# EAGLE design slothbot_sensor_unit_3.0 (EAGLE 9.6.2)
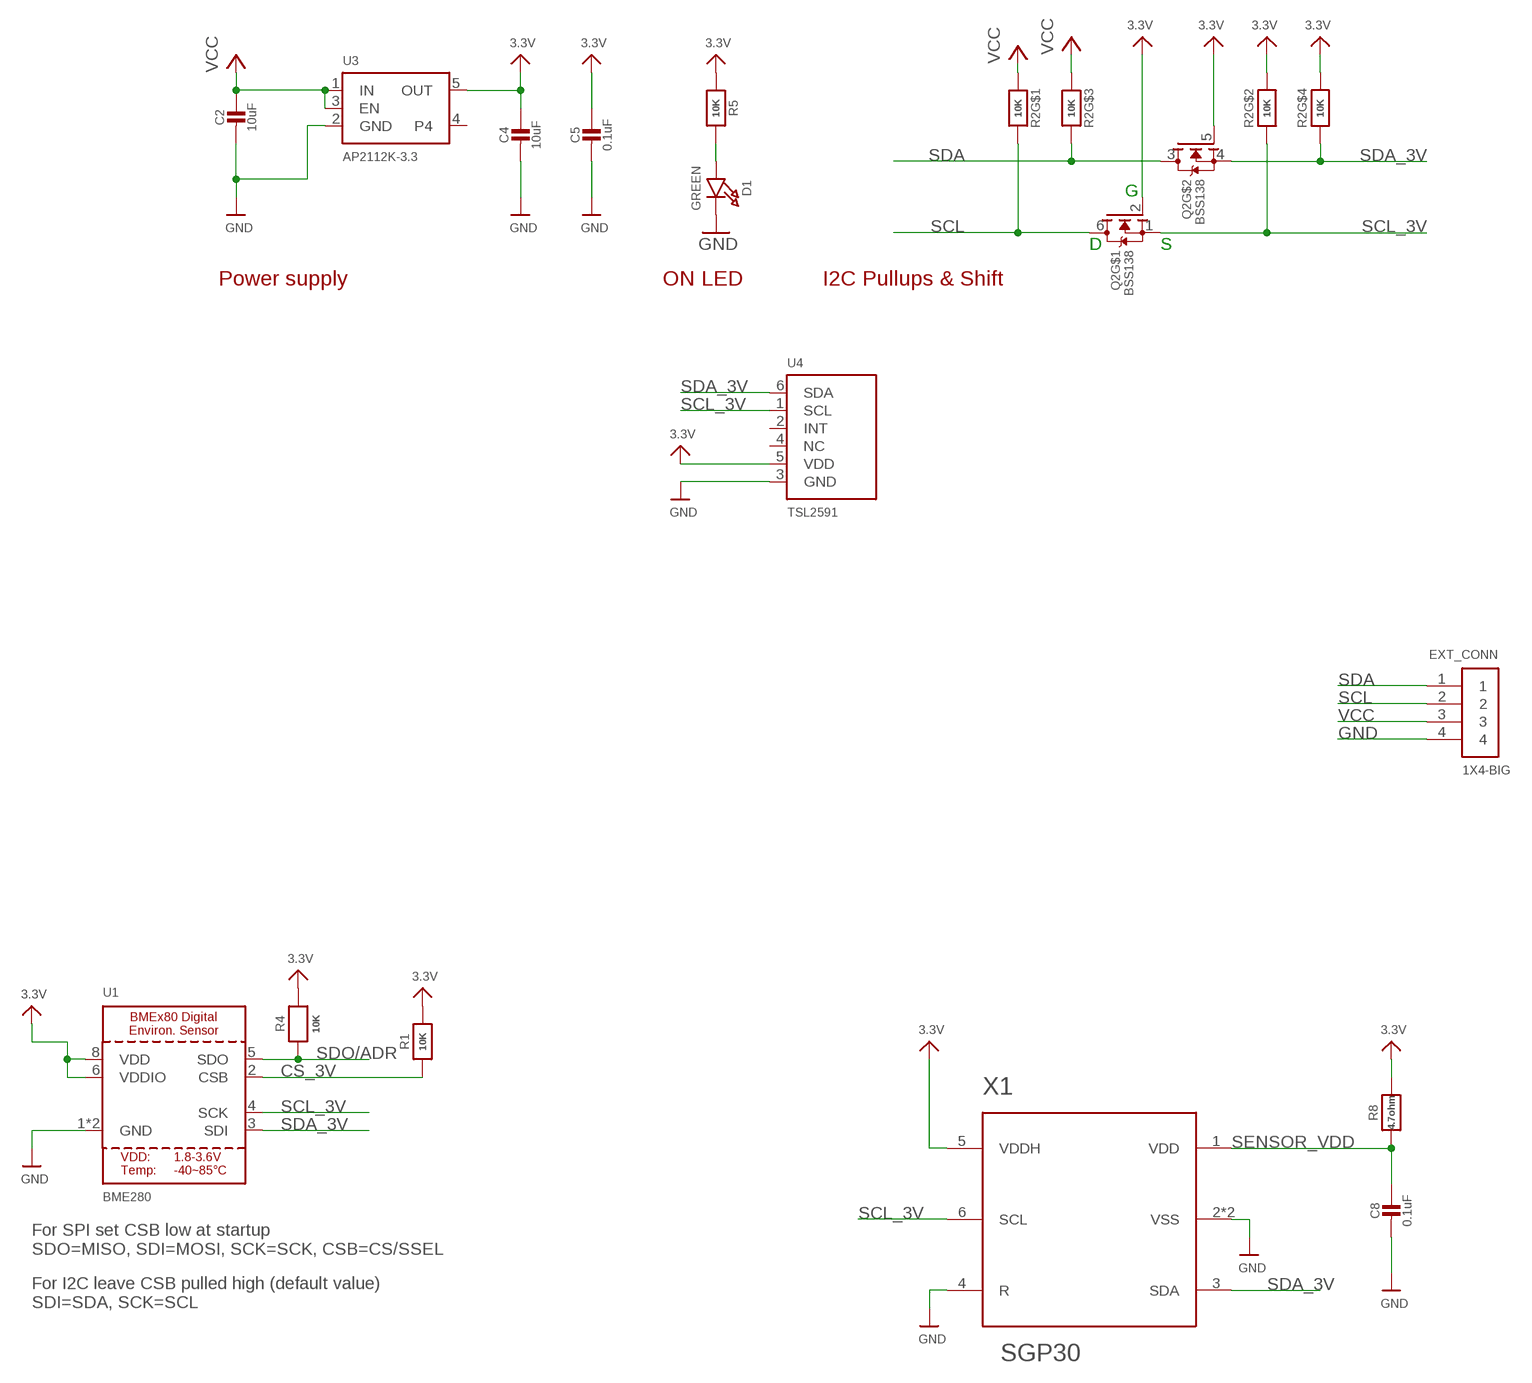
[diagram p0: schematic, sheet 1]

## Parts
C2  10uF  CAP_CERAMIC0805-NOOUTLINE  [0805-NO]
C4  10uF  CAP_CERAMIC0805-NOOUTLINE  [0805-NO]
C5  0.1uF  CAP_CERAMIC0603_NO  [0603-NO]
C8  0.1uF  CAP_CERAMIC0603_NO  [0603-NO]
D1  GREEN  LED0603_NOOUTLINE  [CHIPLED_0603_NOOUTLINE]
EXT_CONN  1X4-BIG  [1X04-BIG]
Q2  BSS138  MOSFET-N_DUAL  [SOT363]
R1  10K  RESISTOR_0603_NOOUT  [0603-NO]
R2  10K  RESISTOR_4PACK  [RESPACK_4X0603]
R4  10K  RESISTOR_0603_NOOUT  [0603-NO]
R5  10K  RESISTOR_0603_NOOUT  [0603-NO]
R8  4.7ohm  RESISTOR_0603_NOOUT  [0603-NO]
U1  BME280  [BME280]
U3  AP2112K-3.3  VREG_SOT23-5  [SOT23-5]
U4  TSL2591  LIGHT_TSL2591  [DFN6_TAOS]
X1  SGP30  [SGP30]

## Nets
3.3V: C4.1 C5.1 Q2.2(G) Q2.5(G) R1.2 R2.2 R2.4 R4.2 R5.1 R8.2 U1.6(VDDIO) U1.8(VDD) U3.5(OUT) U4.5(VDD) X1.5(VDDH)
CS_3V: R1.1 U1.2(CSB)
GND: C2.2 C4.2 C5.2 C8.2 D1.C EXT_CONN.4 U1.1(GND) U1.7(GND) U3.2(GND) U4.3(GND) X1.2(VSS) X1.4(R) X1.P$7(VSS)
N$1: D1.A R5.2
SCL: EXT_CONN.2 Q2.6(D) R2.8
SCL_3V: Q2.1(S) R2.7 U1.4(SCK) U4.1(SCL) X1.6(SCL)
SDA: EXT_CONN.1 Q2.3(D) R2.6
SDA_3V: Q2.4(S) R2.5 U1.3(SDI) U4.6(SDA) X1.3(SDA)
SDO/ADR: R4.1 U1.5(SDO)
SENSOR_VDD [lowpower]: C8.1 R8.1 X1.1(VDD)
VCC [highpower]: C2.1 EXT_CONN.3 R2.1 R2.3 U3.1(IN) U3.3(EN)
Unconnected: U3.4 U4.2(INT) U4.4(NC)

## Notes on the sheet
- G
- D | S
- Power supply | ON LED | I2C Pullups & Shift
- For SPI set CSB low at startup
  SDO=MISO, SDI=MOSI, SCK=SCK, CSB=CS/SSEL
- For I2C leave CSB pulled high (default value)
  SDI=SDA, SCK=SCL

## Library data of the parts
C2 C4 C5 C8 = microbuilder:CAP_CERAMIC: Ceramic Capacitors For new designs, use the packages preceded by an '_' character since they are more reliable: The following footprints should be used on most boards: _0402 - Standard footprint for regular board layouts _0603 - Standard footprint for regular board layouts _0805 - Standard footprint for regular board layouts _1206 - Standard footprint for regular board layouts For extremely tight-pitch boards where space is at a premium, the following 'micro-pitch' footprints can be used (smaller pads, no silkscreen outline, etc.): _0402MP - Micro-pitch footprint for very dense/compact boards _0603MP - Micro-pitch footprint for very dense/compact boards _0805MP - Micro-pitch footprint for very dense/compact boards _1206MP - Micro-pitch footprint for very dense/compact boards
D1 = microbuilder:LED: LED 0603 - 0603 Surface Mount Package 2mA: Green LED - Low Power (3.9mcd, 2ma, 1.7Vf) - Digikey: 475-2709-2-ND Orange LED - Low Power (9.8mcd, 2ma, 1.8Vf) - Digikey: 475-1194-2-ND Red LED - Low Power (5mcd, 2ma, 1.8Vf) - Digikey: 475-1195-2-ND Yellow LED - Low Power (7mcd, 2ma, 1.8Vf) - Digikey: 475-1196-2-ND 5mA: Blue LED - Low Power (17mcd, 5ma, 2.9Vf) - Digikey: LNJ937W8CRACT-ND 0805 - 0805 Surface Mount Package 2mA: Red LED (8.8mcd, 2mA, 1.8Vf, Clear) - Low Power [Digikey: 475-2510-1-ND] Green LED (5mcd, 2mA, 1.8Vf, Clear) - Low Power [Digikey: 475-2730-1-ND] Yellow LED (11.3mcd, 2mA, 1.8Vf, Clear) - Low Power [Digikey: 475-2555-1-ND] 20mA: Red LED (104mcd, 20mA, Diffused) - LS R976 [Digikey: 475-1278-6-ND] Red LED (12mcd, 20mA, 2.0Vf, Clear) - APT2012EC [Digikey: 754-1128-1-ND] Green LED (15mcd, 20mA, 2.2Vf, Clear) - APT2012GC [Digikey: 754-1131-1-ND] Orange LED (160mcd, 20mA, 2.1Vf, Clear) - APT2012SECK [Digikey: 754-1130-1-ND] 1206 - 1206 Surface Mount Package Green LED (26mcd, 20mA, Diffused) - LG N971 [Digikey: 475-1407-6-ND] Red LED (15mcd, 20mA, Diffused) - LH N974 [Digikey: 475-1416-6-ND] Cree - Cree High-Power Surface Mount LEDs XPEBWT-L1-0000-00D50 - White 111lm 350mA 2.9Vf 6200K 110° XTEAWT-00-0000-00000LEE3 - White 114lm 350mA 2.85Vf 5000K 115° Everlight - Everlight 45-21 Series Surface Mount LEDs 45-21/QK2C-B2832AC2CB2/2T - Warm White 2000mcd 20mA 3.25Vf 3050K 120° 45-21/LK2C-B38452C4CB2/2T - Nuetral White 2000mcd 20mA 3.25Vf 4150K 120° 45-21/LK2C-B50634C6CB2/2T - Cold White 2200mcd 20mA 3.25Vf 5650K 120° PLCC2 Reverse Mount LS T77K-J1L2-1-0-2-R18-Z - Red 11.25mcd 2mA 1.8Vf 630nm 120° LO T77K-L1M2-24-Z - Orange 19.6mcd 2mA 1.8Vf 606nm 120° LY T77K-K2M1-26-Z - Yellow 15.7mcd 2mA 1.8Vf 587nm 120°
EXT_CONN = adafruit:1X4: 4-pin connector
Q2 = microbuilder:MOSFET-N_DUAL: Dual N-Channel MOSFET SOT363 (2.0x1.25mm) 2N7002PS - 60V, 320mA [Digikey: 568-5984-1-ND]
R1 R4 R5 R8 = microbuilder:RESISTOR: Resistors For new designs, use the packages preceded by an '_' character since they are more reliable: The following footprints should be used on most boards: _0402 - Standard footprint for regular board layouts _0603 - Standard footprint for regular board layouts _0805 - Standard footprint for regular board layouts _1206 - Standard footprint for regular board layouts For extremely tight-pitch boards where space is at a premium, the following 'micro-pitch' footprints can be used (smaller pads, no silkscreen outline, etc.): _0402MP - Micro-pitch footprint for very dense/compact boards _0603MP - Micro-pitch footprint for very dense/compact boards _0805MP - Micro-pitch footprint for very dense/compact boards _1206MP - Micro-pitch footprint for very dense/compact boards
R2 = microbuilder:RESISTOR_4PACK: Resistor Packs (4 resistors) 4 x 0603 10K 1/16W - Digikey: YC164J-10KCT-ND
U1 = microbuilder:BME280: BME280 - Environmental Sensor (I2C + SPI)
U3 = microbuilder:VREG_SOT23-5: SOT23-5 Fixed Voltage Regulators Part Current Out V Out V In V Dropout θJA (°C/W) TJ (°C) Digikey Part No. ADP121 150mA 3.3V 3.4-5.5V 0.09V @ 150mA -- -- ADP121-AUJZ33R7CT-ND ADP121 150mA 3.0V 3.1-5.5V 0.09V @ 150mA -- -- ADP121-AUJZ30R7CT-ND ADP122 300mA 3.3V 3.4-5.5V 0.085V @ 300mA -- -- ADP122AUJZ-3.3-R7CT-ND ADP1712 300mA 3.3V 3.5-5.5V 0.17V @ 300mA -- -- ADP1712AUJZ-3.3-R7TR-ND AP7311 (Low Cost) 150mA 3.3V 3.5-6V 0.15V @ 150mA -- -- AP7311-33WG-7DICT-ND LD39015M18R 150mA 1.8V 1.9V-5.5V 0.08V @ 100mA -- -- 497-6977-1-ND LP2985A-33DBVR 150mA 3.3V 3.3-16V 0.28V @ 150mA 206 150 296-18479-1-ND MCP1824T-3302E/OT 300mA 3.3V 3.5V-6V 0.2V @ 300mA -- -- MCP1824T-3302E/OTCT-ND MIC5205-2.5YM5 TR 150mA 2.5V 2.7-16V 0.165V @ 150mA -- -- 576-1257-2-ND MIC5205-3.0YM5 TR 150mA 3.0V 3.2V-16V 0.165V @ 150mA -- -- 576-1258-2-ND MIC5205-3.3YM5 TR 150mA 3.3V 3.5V-16V 0.165V @ 150mA -- -- 576-1259-2-ND TPS780330220 150mA 3.3V+2.2V 3.6-5.5V 250mV Max -- -- 296-23332-1-ND TDA3663/N1,135 100mA 3.3V 3.5-45V 0.18V @ 50mA -- -- 568-5343-1-ND Max operating temp can be calculated using θJA, TJ (max junction temperature), and power in watts. Set the "Maximum Ambient Temperature" until it reaches TJ ("Max Junction Temperature"), which is the absolute limit for safe use of the regulator: Heat Sink Temperature Calculator <http://www.daycounter.com/Calculators/Heat-Sink-Temperature-Calculator.phtml> For example, With 12V source into a 3.3V LP2985 and a 30mA load, we are dissipating (12V-3.3V) * 0.03A = 0.261W. With a θJA of 206 °C/W, a TJ of 150°C, and 261mW we can safely use the chip without a heat sink up to 75°C (=147.1°C Junction Temperature).
U4 = microbuilder:LIGHT_TSL2591: TSL2591 Light-To-Digital Sensor
X1 = microbuilder:SGP30: Sensirion SGP30 multi-pixel gas sensor

## Net classes
1 highpower: width 0.305 mm, drill 0.483 mm
2 lowpower: width 0.254 mm, drill 0.483 mm

## Board
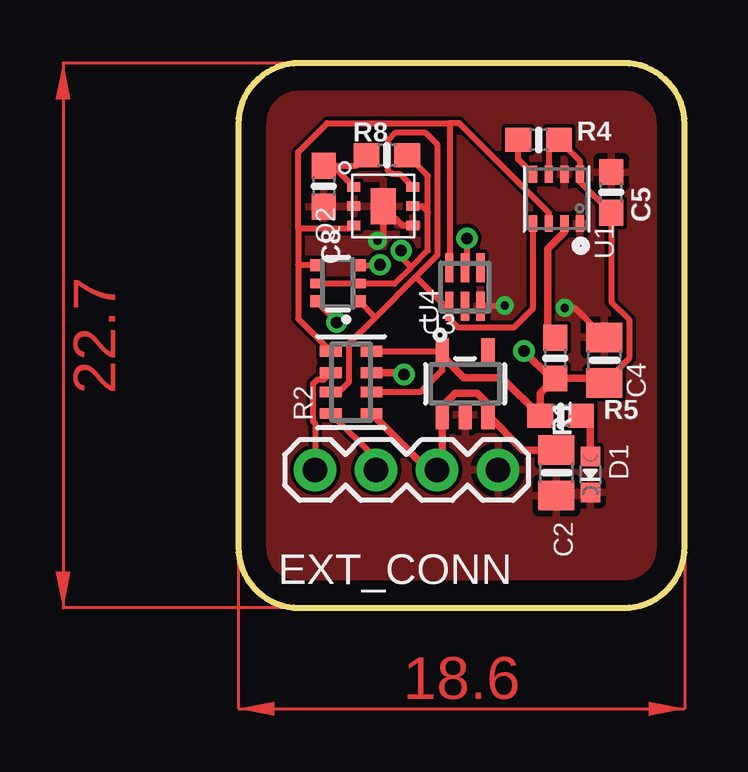
[diagram p1: board, top side]
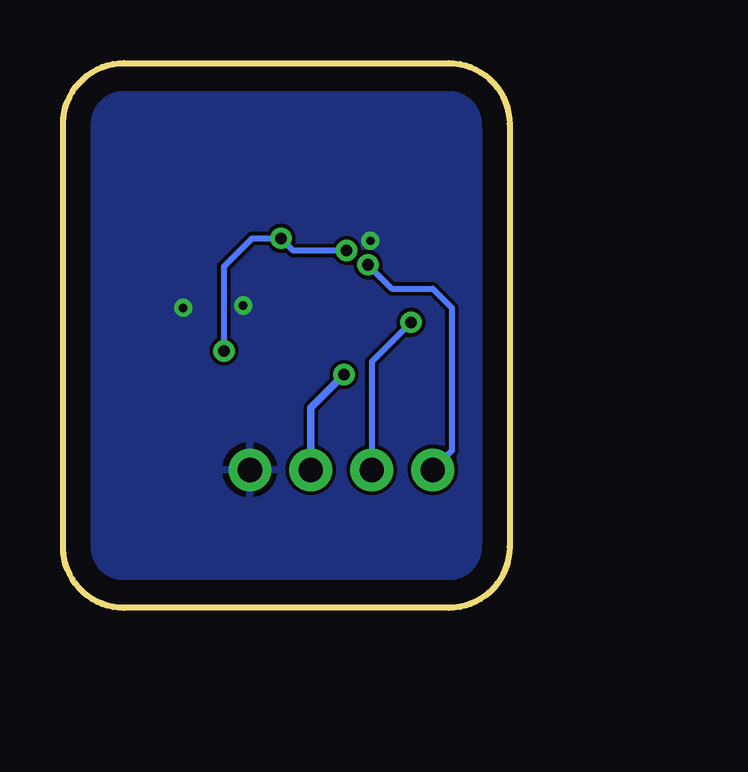
[diagram p2: board, bottom side, seen from below]

Size 18.6 x 22.7 mm. Coordinates in mm from the lower left corner, seen from the top.
Outline: 0,20.16 0,2.54 arc90 2.54,0 16.06,0 arc90 18.6,2.54 18.6,20.16 arc90 16.06,22.7 2.54,22.7 arc90 0,20.16
Copper layers (1*16): Top 0.035mm / dielectric 1.5mm / Bottom 0.035mm
Design rules "default": minimum track width 6mil, minimum drill 0.35mm, track to track 6mil, track to pad 6mil, pad to pad 6mil, via to via 6mil, smd to smd 6mil, copper to edge 40mil, drill to drill 6mil, minimum pad ring 10mil, minimum via ring 8mil, stop-mask expansion 4mil, vias tented up to drill 0mil, thermal gap 10mil

### Footprints (pad centres in the part's own frame; a part is rotated, then mirrored left to right if it is on the bottom)
0805-NO = smd 1.24 x 1.5: 1 -0.95,0; 2 0.95,0
0603-NO = smd 1.075 x 1: 1 -0.85,0; 2 0.85,0
CHIPLED_0603_NOOUTLINE = smd 0.8 x 0.8: A 0,-0.75; C 0,0.75
1X04-BIG = drill 1.016 pad 1.778: 1 0,0; 2 2.54,0; 3 5.08,0; 4 7.62,0
SOT363 = smd 0.5 x 0.5: 1 -0.75,-0.9; 3 0.75,-0.9; 4 0.75,0.9; 6 -0.75,0.9 | smd 0.4 x 0.5: 2 0,-0.9; 5 0,0.9
RESPACK_4X0603 = smd 0.45 x 0.9: 1 -1.3,-0.85; 2 -0.4,-0.85; 3 0.4,-0.85; 4 1.3,-0.85; 5 1.3,0.85; 6 0.4,0.85; 7 -0.4,0.85; 8 -1.3,0.85
BME280 = smd 0.7 x 0.35: 1 1.025,0.975; 2 1.025,0.325; 3 1.025,-0.325; 4 1.025,-0.975; 5 -1.025,-0.975; 6 -1.025,-0.325; 7 -1.025,0.325; 8 -1.025,0.975
SOT23-5 = smd 0.55 x 1.2: 1 -0.95,-1.3; 2 0,-1.3; 3 0.95,-1.3; 4 0.95,1.3; 5 -0.95,1.3
DFN6_TAOS = smd 1.2 x 0.35: 1 -0.8,0.65; 2 -0.8,0; 3 -0.8,-0.65; 4 0.8,-0.65; 5 0.8,0; 6 0.8,0.65
SGP30 = smd 0.55 x 0.4: 1 -1.225,0.8; 2 -1.225,0; 3 -1.225,-0.8; 4 1.225,-0.8; 5 1.225,0; 6 1.225,0.8 | smd 1.05 x 1.5: P$7 0,0

### Placement (x,y rotation side)
C2  13.25,5.63 270 top
C4  15.25,10.32 90 top
C5  15.54,17.31 90 top
C8  3.56,17.57 270 top
D1  14.67,5.56 180 top
EXT_CONN  3.2,5.75 0 top
Q2  4.15,13.52 90 top
R1  13.2,10.41 270 top
R2  4.7,9.4 90 top
R4  12.51,19.5 0 top
R5  13.43,8 0 top
R8  6.19,18.86 0 top
U1  13.26,17.04 270 top
U3  9.45,9.34 0 top
U4  9.44,13.37 90 top
X1  6.04,16.74 0 top

### Tracks (layer width: path | path; a pad name or v marks a point on that pad's centre or on a via)
3.3V  (via drill 0.48)
  Top 0.254: R2.2 7.6,9 8.5,9.9 8.5,10.5 U3.5 8.44,10.7 R2.4 | X1.5 7.66,16.74 7.9,16.5 | 7.9,16.5 7.9,14.9 7.2,14.2 | 7.2,14.2 6.5,13.5 5.07,13.5 Q2.2 Q2.5 | U1.6 12.94,19.07 R4.2 14.24,18.62 U1.8 14.24,17.77 C5.1 15.54,12.74 16.28,12.01 16.28,10.4 C4.1 | 7.9,16.5 7.9,18 R8.2 | 7.2,14.2 6.79,14.61 v6.79,14.89 | v9.52,15.4 9.52,14.25 U4.5
  Top 0.305: 8.5,10.5 9.4,9.6 10.98,9.6 R5.1 12.58,8.94 R1.2 | R1.2 15.06,9.56 C4.1 | R1.2 13.04,9.56 v11.9,10.7
  Bottom 0.254: v6.79,14.89 9.01,14.89 v9.52,15.4 10.72,15.4 11.9,14.22 v11.9,10.7
CS_3V
  Top 0.305: U1.2 13.59,15.64 12.9,14.96 12.9,11.56 R1.1
GND  (via drill 0.35)
  Top 0.254: U4.3 10.12,12.6 v11.1,12.6 | C4.2 14.02,12.5 v13.6,12.5 | v5.8,15.3 6.04,15.54 X1.P$7 6.84,15.94 X1.4
  pour Top: -0.1,23.5 17.9,23.5 19.5,21.9 19.5,1.7 17.1,-0.7 1.5,-0.7 -0.7,1.5 -0.7,22.9
  pour Bottom: -0.1,23.2 17.6,23.2 19,21.8 19.3,21.5 19.3,1.5 17,-0.8 1.7,-0.8 -1,1.9 -1,2.1 -1,22.3
N$1
  Top 0.305: D1.A 14.67,7.61 R5.2
SCL  (via drill 0.48)
  Top 0.254: R2.8 5.74,6.21 EXT_CONN.2 | Q2.6 4.1,11.92 v4.1,11.9
  Bottom 0.254: v4.1,11.9 5.74,10.26 EXT_CONN.2
SCL_3V
  Top 0.254: R2.7 4.2,9 4.62,9.42 4.62,11.02 5.7,12.1 | Q2.1 5.7,12.12 5.7,12.1 | 5.7,12.1 7.4,13.8 | 7.4,13.8 8.31,14.71 8.31,19.29 7.81,19.79 6.54,19.79 6.22,19.48 6.22,18.24 6.39,18.08 6.72,18.08 X1.6 | 7.4,13.8 8.63,12.57 U4.1 8.79,12.05 9.15,11.69 11.49,11.69 12.29,12.48 U1.4
SDA  (via drill 0.48)
  Top 0.254: R2.6 3.55,9.5 3.28,9.5 3.12,9.34 3.12,7.76 3.2,7.68 EXT_CONN.1 | Q2.3 5.87,14.27 v5.9,14.3
  Bottom 0.254: v5.9,14.3 4.9,13.3 3.2,13.3 2.4,12.5 2.4,6.55 EXT_CONN.1
SDA_3V
  Top 0.254: R2.5 2.49,12.06 2.49,14.3 | 2.49,15.8 2.49,14.3 | X1.3 4.68,15.8 2.49,15.8 | 8.8,20.2 3.7,20.2 2.49,18.99 2.49,15.8 | 8.8,20.2 U4.6 | U1.3 12.94,16.46 9.2,20.2 8.8,20.2 | Q2.4 2.52,14.27 2.49,14.3
SDO/ADR
  Top 0.254: U1.5 11.66,18.69 R4.1
SENSOR_VDD
  Top 0.254: X1.1 3.94,18.42 C8.1 4.9,18.42 R8.1
VCC  (via drill 0.48)
  Top 0.305: R2.1 7.9,5.75 EXT_CONN.3 8.5,5.97 U3.1 8.5,8.4 9.05,8.95 9.96,8.95 10.4,8.5 U3.3 11.86,6.58 C2.1 | R2.3 6.82,9.8 v6.9,9.72
  Bottom 0.305: v6.9,9.72 8.28,8.34 EXT_CONN.3
(copper drawn outside any net)
  shapes: Top area x2